# EAGLE design LNA (EAGLE 6.5.0)
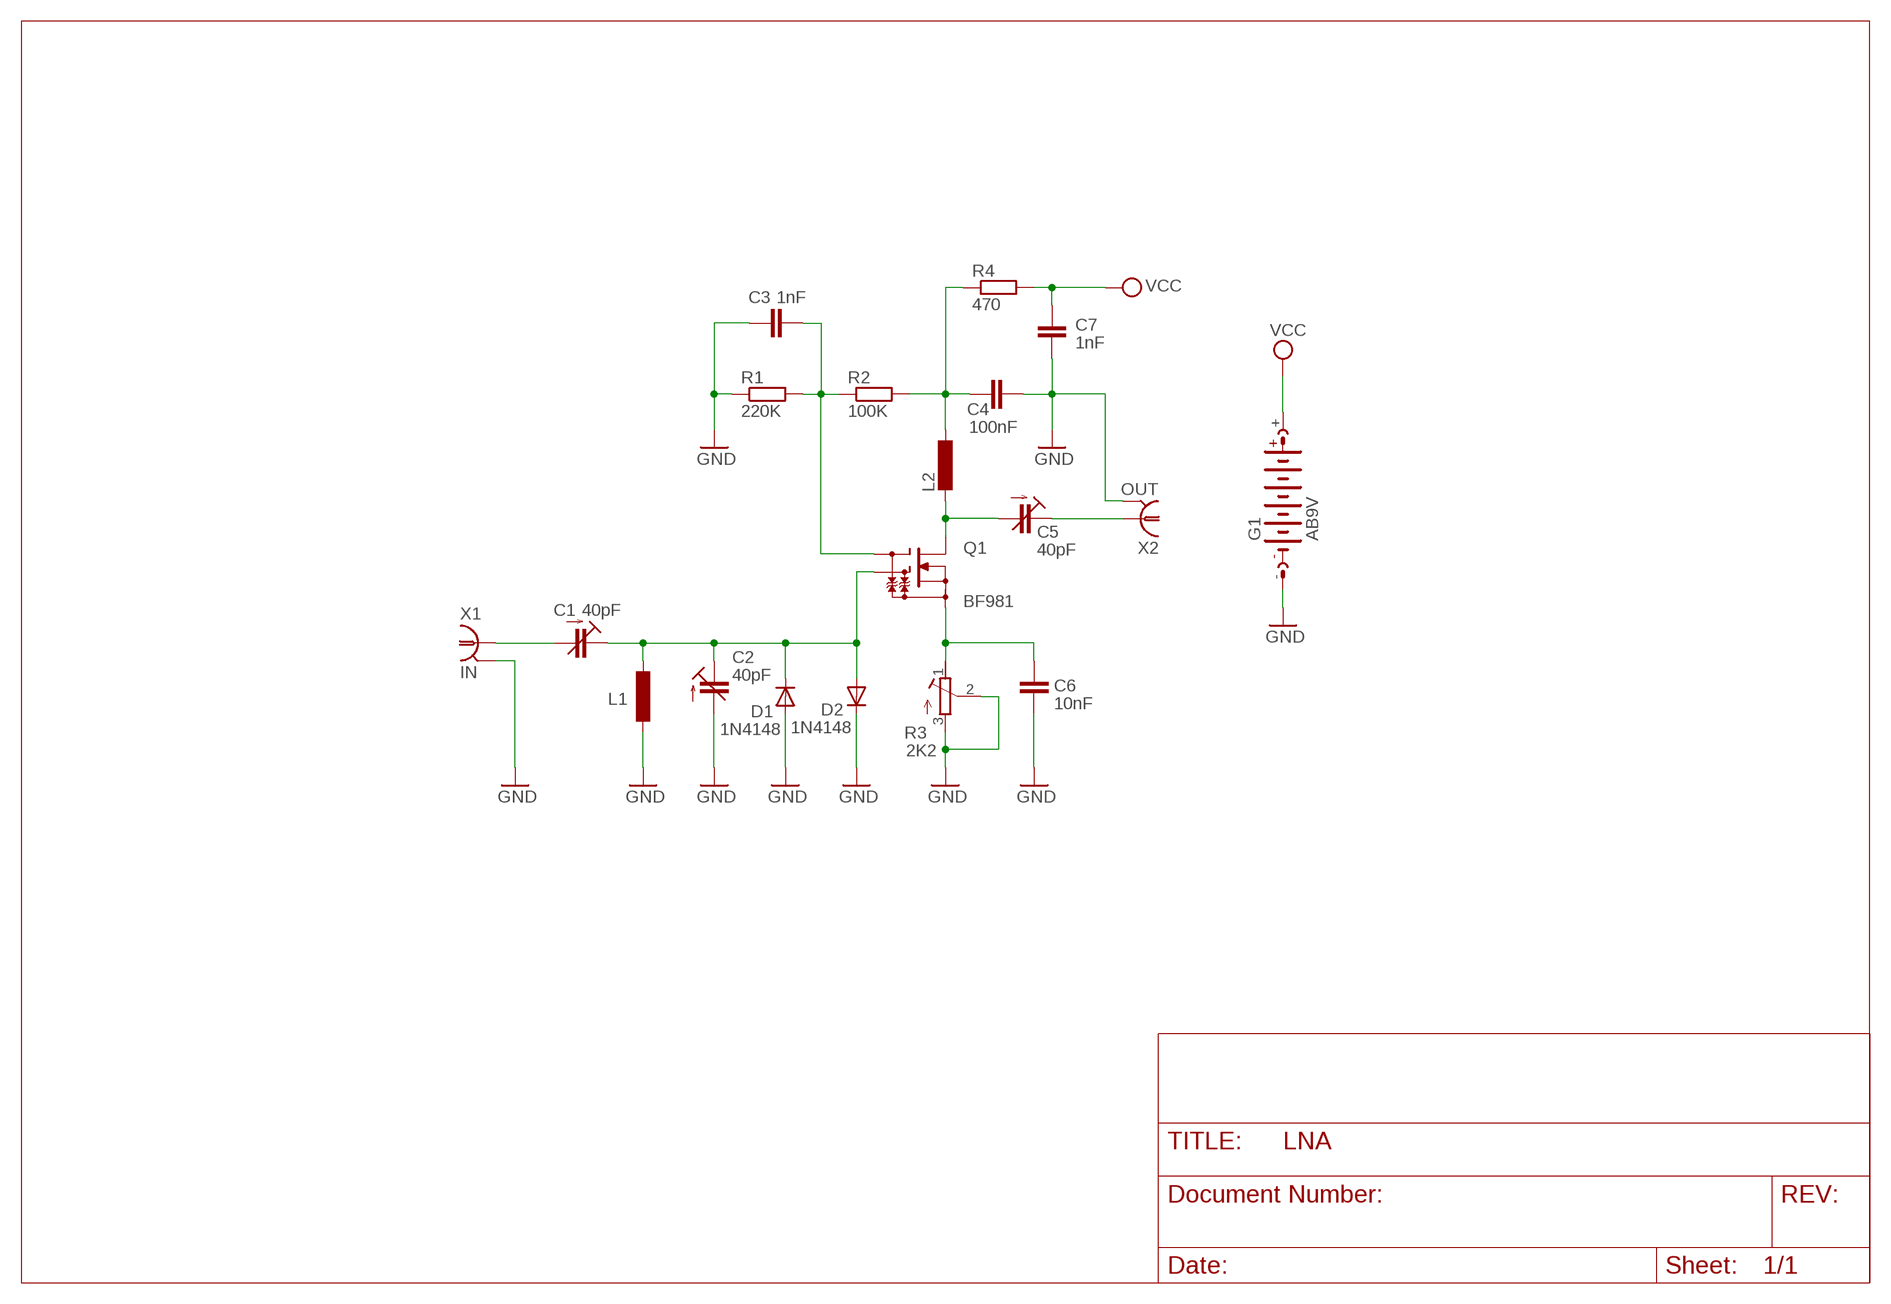
[diagram p0: schematic, sheet 1]

## Parts
C1  40pF  C-TRIMM808  [CTRIM808-BC]
C2  40pF  C-TRIMM808  [CTRIM808-BC]
C3  1nF  C-EU050-025X075  [C050-025X075]
C4  100nF  C-EU050-025X075  [C050-025X075]
C5  40pF  C-TRIMM808  [CTRIM808-BC]
C6  10nF  C-EU050-025X075  [C050-025X075]
C7  1nF  C-EU050-025X075  [C050-025X075]
D1  1N4148  1N4148DO35-7  [DO35-7]
D2  1N4148  1N4148DO35-7  [DO35-7]
G1  AB9V  [AB9V]
L1  L-EU0204/5  [0204/5]
L2  L-EU0204/5  [0204/5]
Q1  BF981  [SOT103]
R1  220K  R-EU_0207/10  [0207/10]
R2  100K  R-EU_0207/10  [0207/10]
R3  2K2  R-TRIMM43P  [RTRIM43P]
R4  470  R-EU_0207/10  [0207/10]
X1  IN  A1944-50  [A1944]
X2  OUT  A1944-50  [A1944]

## Nets
GND: C2.2(A) C3.1 C4.2 C6.2 C7.2 D1.A D2.C G1.- L1.2 R1.1 R3.2(S) R3.3(E) X1.2 X1.3 X1.4 X1.5 X2.2 X2.3 X2.4 X2.5
N$1: C4.1 L2.1 R2.2 R4.1
N$3: C3.2 Q1.4-G1(G1) R1.2 R2.1
N$4: C1.1(E) C2.1(E) D1.C D2.A L1.1 Q1.3-G2(G2)
N$6: C5.2(A) L2.2 Q1.2-D(DRAIN)
N$7: C5.1(E) X2.1
N$8: C1.2(A) X1.1
N$9: C6.1 Q1.1-S(SOURCE) R3.1(A)
VCC: C7.1 G1.+ R4.2

## Library data of the parts
C1 C2 C5 = resistor:C-TRIMM: Trimm capacitor
C3 C4 C6 C7 = resistor:C-EU: CAPACITOR, European symbol
D1 D2 = diode:1N4148: DIODE high speed (Philips)
G1 = battery:AB9V: 9-V BATTERY CLIP
L1 L2 = resistor:L-EU: INDUCTOR, European symbol
Q1 = transistor-fet:BF98*: N-CHANNEL Dual Gate MOS-FET Source: BF981.pdf
R1 R2 R4 = resistor:R-EU_: RESISTOR, European symbol
R3 = resistor:R-TRIMM: Trimm resistor
X1 X2 = con-coax:A1944-50: BNC CONNECTOR 50 Ohm distributor Buerklin 78F2475; OC_FARNELL: unknown; OC_NEWARK: unknown

## Net classes
0 default: width 1 mm, drill 1 mm, clearance 0.5 mm

## Board
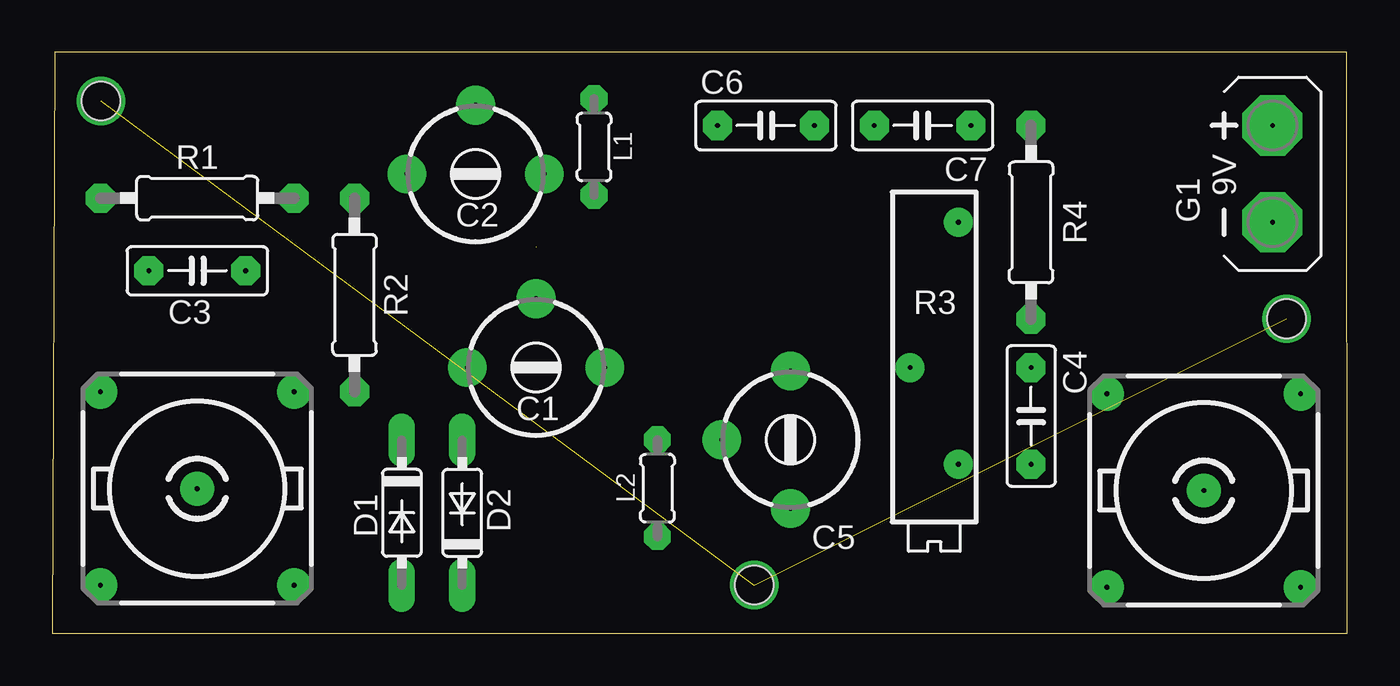
[diagram p1: board, top side]
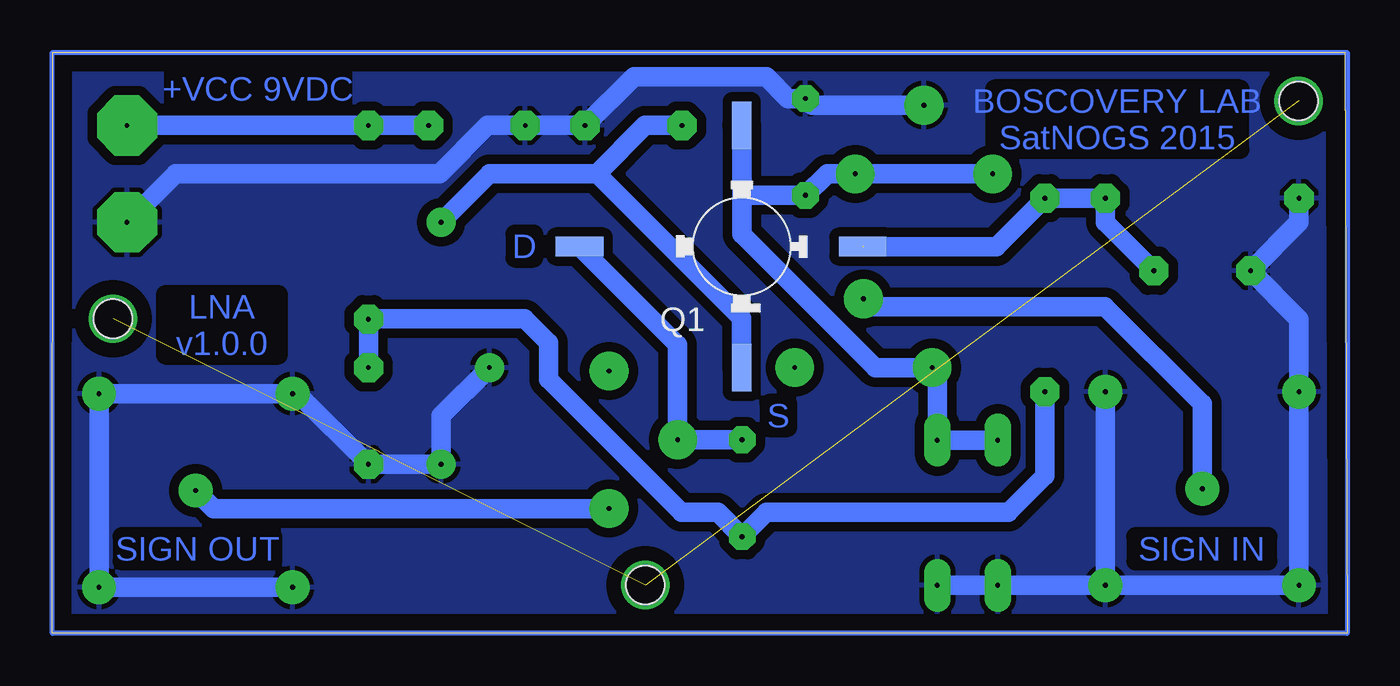
[diagram p2: board, bottom side, seen from below]

Size 67.95 x 30.49 mm. Coordinates in mm from the lower left corner, seen from the top.
Outline: 0,0 67.94,0 67.93,30.48 0.11,30.48 0,0
Copper layers (1*16): Top 0.035mm / dielectric 1.5mm / Bottom 0.035mm
Design rules "default": minimum track width 10mil, minimum drill 24mil, track to track 8mil, track to pad 8mil, pad to pad 8mil, via to via 8mil, smd to smd 8mil, copper to edge 40mil, drill to drill 8mil, minimum pad ring 10mil, minimum via ring 8mil, stop-mask expansion 4mil, vias tented up to drill 0mil, thermal gap 10mil
Holes 2.03 mm at 36.83,2.54 64.77,16.51 2.54,27.94

### Footprints (pad centres in the part's own frame; a part is rotated, then mirrored left to right if it is on the bottom)
CTRIM808-BC = drill 0.254 pad 2.032: 1 -3.607,0; 2 0,3.607; 3 3.607,0
C050-025X075 = drill 0.254 pad 1.524 octagon: 1 -2.54,0; 2 2.54,0
DO35-7 = drill 0.254 pad 1.397 long: A 3.81,0; C -3.81,0
AB9V = drill 0.254 pad 3.15 octagon: + 0,2.54; - 0,-2.54
0204/5 = drill 0.254 pad 1.397 octagon: 1 -2.54,0; 2 2.54,0
SOT103 = smd 1 x 2.5: 1-S 0,6.35; 3-G2 0,-6.35 | smd 2.5 x 1: 2-D 8.51,0; 4-G1 -6.35,0
0207/10 = drill 0.254 pad 1.524 octagon: 1 -5.08,0; 2 5.08,0
RTRIM43P = drill 0.254 pad 1.524: 1 -7.62,1.27; 2 0,-1.27; 3 5.08,1.27
A1944 = drill 0.254 pad 1.778: 1 0,0; 2 5.08,5.08; 3 -5.08,5.08; 4 -5.08,-5.08; 5 5.08,-5.08

### Placement (x,y rotation side)
C1  25.38,13.95 0 top
C2  22.2,24.11 0 top
C3  7.6,19.03 0 top
C4  51.36,11.41 270 top
C5  38.73,10.16 90 top
C6  37.44,26.65 0 top
C7  45.67,26.65 180 top
D1  18.33,6.33 270 top
D2  21.51,6.33 90 top
G1  64.03,24.11 0 top
L1  28.43,25.52 90 top
L2  31.75,7.62 90 top
Q1  31.77,20.3 180 bottom
R1  7.6,22.84 0 top
R2  15.85,17.76 270 top
R3  46.28,13.95 270 top
R4  51.36,21.57 90 top
X1  7.6,7.6 0 top
X2  60.42,7.5 0 top

### Tracks (layer width: path | path; a pad name or v marks a point on that pad's centre or on a via)
*  (via drill 0.25 pad 2.54)  (2 unrouted)
  other vias: 2.54,27.94 36.83,2.54 64.77,16.51
GND
  Bottom 1.016: R1.1 2.52,21.57 C3.1 2.52,16.49 X1.3 X1.4 X1.5 | R3.2 47.55,11.41 R3.3 C4.2 55.07,12.58 X2.3 X2.2 X2.5 X2.4 55.24,2.52 | G1.- 61.47,24.13 47.62,24.13 45.1,26.65 C7.2 C6.2 37.42,29.21 30.48,29.21 29.33,28.06 L1.2 28.08,27.72 C2.2 | X1.2 X1.5 | X1.5 D1.A D2.C
  pour Bottom: 0,30.48 0,0 67.94,0 67.94,30.48
N$1
  Bottom 1.016: C4.1 R4.1 51.34,16.51 43.18,16.51 41.91,15.24 41.91,13.34 34.92,6.35 33.02,6.35 L2.1 30.48,6.35 17.78,6.35 15.86,8.28 R2.2
N$2
  Bottom 0.254: 0,30.48 0,0 67.94,0 67.94,30.48 0,30.48
N$3  (1 unrouted)
  Bottom 1.016: C3.2 12.68,21.57 R1.2 R2.1 18.39,20.3 25.38,20.3
N$4
  Bottom 1.016: D1.C D2.A 21.51,13.69 C1.1 24.75,13.95 31.75,20.95 31.75,22.86 | 31.75,22.86 31.75,26.63 Q1.3-G2 | C2.1 26.02,24.11 26.04,24.13 27.28,24.13 L1.1 31.63,22.98 31.75,22.86
N$6
  Bottom 1.016: Q1.2-D 35.13,15.15 C5.2 L2.2
N$7
  Bottom 1.016: C5.1 59.48,6.55 X2.1
N$8
  Bottom 1.016: X1.1 7.6,12.04 12.7,17.14 24.97,17.14 C1.2
N$9
  Bottom 1.016: C6.1 36.85,26.65 39.37,24.13 | 39.37,24.13 44.99,24.13 R3.1 | Q1.1-S 31.77,16.53 39.37,24.13
VCC
  Bottom 1.016: C7.1 R4.2 G1.+

### Text on the board
Bottom: BOSCOVERY LAB / SatNOGS 2015 | +VCC 9VDC | D | LNA / v1.0.0 | S | SIGN IN | SIGN OUT